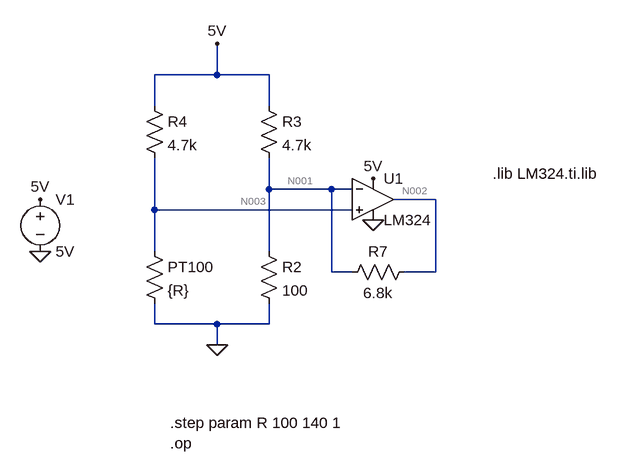
[diagram p0: schematic Simulation_LM324.asc]
Simulation_LM324.asc, the LTspice schematic file:
Version 4
SHEET 1 880 680
WIRE -16 -80 -16 -128
WIRE -16 -80 -112 -80
WIRE 64 -80 -16 -80
WIRE -112 -32 -112 -80
WIRE 64 -32 64 -80
WIRE 64 96 64 48
WIRE 160 96 64 96
WIRE 192 96 160 96
WIRE 320 112 256 112
WIRE -112 128 -112 48
WIRE 192 128 -112 128
WIRE -112 192 -112 128
WIRE 64 192 64 96
WIRE 160 224 160 96
WIRE 192 224 160 224
WIRE 320 224 320 112
WIRE 320 224 272 224
WIRE -112 304 -112 272
WIRE -16 304 -112 304
WIRE 64 304 64 272
WIRE 64 304 -16 304
WIRE -16 336 -16 304
FLAG -288 192 0
FLAG -288 112 5V
FLAG 224 144 0
FLAG 224 80 5V
FLAG -16 336 0
FLAG -16 -128 5V
SYMBOL Opamps\\opamp2 224 48 R0
SYMATTR InstName U1
SYMATTR Value LM324
SYMBOL res -128 176 R0
SYMATTR InstName PT100
SYMATTR Value {R}
SYMBOL res 48 176 R0
SYMATTR InstName R2
SYMATTR Value 100
SYMBOL res 48 -48 R0
SYMATTR InstName R3
SYMATTR Value 4.7k
SYMBOL res -128 -48 R0
SYMATTR InstName R4
SYMATTR Value 4.7k
SYMBOL voltage -288 96 R0
WINDOW 123 0 0 Left 0
WINDOW 39 0 0 Left 0
SYMATTR InstName V1
SYMATTR Value 5V
SYMBOL res 288 208 R90
WINDOW 0 0 56 VBottom 2
WINDOW 3 32 56 VTop 2
SYMATTR InstName R7
SYMATTR Value 6.8k
TEXT 408 72 Left 2 !.lib LM324.ti.lib
TEXT -88 456 Left 2 !.step param R 100 140 1\n.op

The netlist it stands for:
* Simulation_LM324.asc
XU1 N003 N001 5V 0 N002 LM324  ; pins In+ In- V+ V- OUT
R§PT100 N003 0 {R}
R2 N001 0 100
R3 5V N001 4.7k
R4 5V N003 4.7k
V1 5V 0 5V
R7 N002 N001 6.8k
.lib LM324.ti.lib
.step param R 100 140 1
.op
.backanno
.end

* Results of the author's LTspice run, read from the files saved beside the schematic
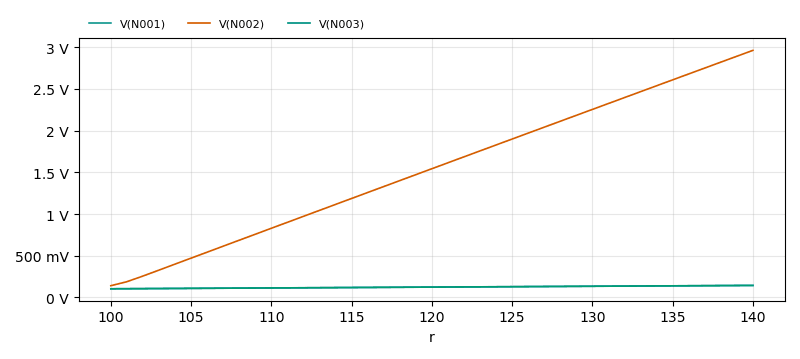
[diagram p1: Operating Point of Simulation_LM324.asc, plotted from the saved traces]
* Operating Point, 1 run:
*   V(N001): 104.7 mV at r=100 , 144.7 mV at r=140 , min 104.7 mV, max 144.7 mV
*   V(N002): 141.2 mV at r=100 , 2.961 V at r=140 , min 141.2 mV, max 2.961 V
*   V(N003): 104.2 mV at r=100 , 144.6 mV at r=140 , min 104.2 mV, max 144.6 mV
* From the log:
*   Semiconductor Device Operating Points:
*                           --- Diodes ---
*   Name:    d:u1:p      d:u1:ln     d:u1:lp     d:u1:e      d:u1:c
*   Model:    u1:dx       u1:dx       u1:dx       u1:dx       u1:dx
*   Id:     -5.00e-12   -4.00e-11   -4.00e-11    4.04e-08   -2.76e-12
*   Vd:     -5.00e+00   -4.00e+01   -4.00e+01    4.59e-01   -2.76e+00
*   Req:     1.00e+12    1.00e+12    1.00e+12    6.40e+05    1.00e+12
*   CAP:     0.00e+00    0.00e+00    0.00e+00    0.00e+00    0.00e+00
*                           --- Bipolar Transistors ---
*   Name:     q:u1:2      q:u1:1
*   Model:     u1:qx       u1:qx
*   Ib:      -2.03e-08   -2.00e-08
*   Ic:      -5.08e-06   -5.01e-06
*   Vbe:     -5.84e-01   -5.83e-01
*   Vbc:      6.38e-02    6.48e-02
*   Vce:     -6.48e-01   -6.48e-01
*   BetaDC:   2.50e+02    2.50e+02
*   Gm:       1.96e-04    1.94e-04
*   Rpi:      1.27e+06    1.29e+06
*   Rx:       0.00e+00    0.00e+00
*   Ro:       3.80e+14    3.96e+14
*   Cbe:      0.00e+00    0.00e+00
*   Cbc:      0.00e+00    0.00e+00
*   Cjs:      0.00e+00    0.00e+00
*   BetaAC:   2.50e+02    2.50e+02
*   Cbx:      0.00e+00    0.00e+00
*   Ft:       0.00e+00    0.00e+00